# EAGLE design BigTime (EAGLE 6.4)
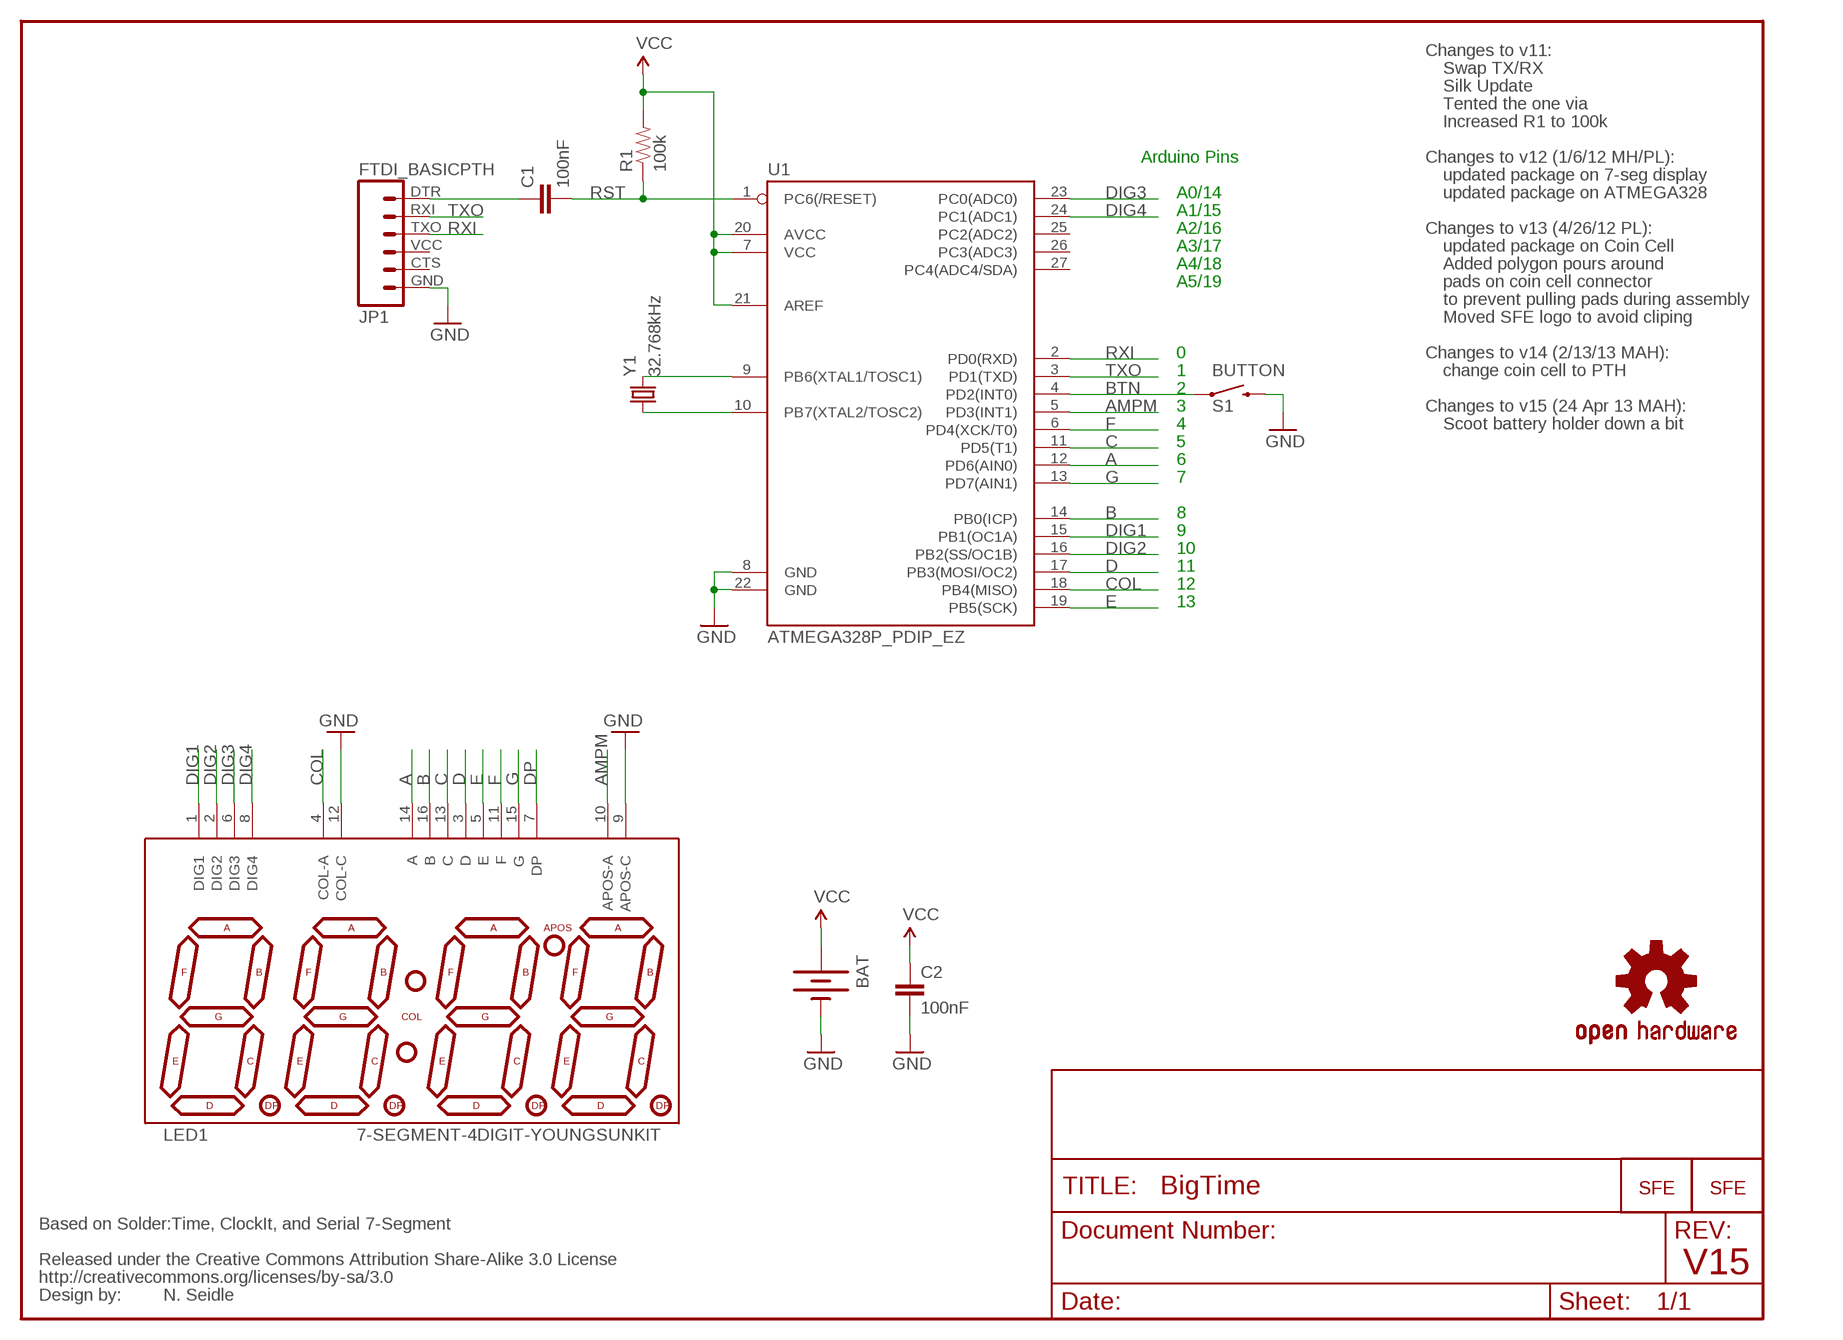
[diagram p0: schematic, sheet 1]

## Parts
BAT  BATTERYFOB  [BATTERY_20MM_PTH_COMPACT]
C1  100nF  CAPEZ  [CAP-PTH-SMALLEZ]
C2  100nF  CAPEZ  [CAP-PTH-SMALLEZ]
JP1  FTDI_BASICPTH  [FTDI_BASIC]
LED1  7-SEGMENT-4DIGIT-YOUNGSUNKIT  [7-SEGMENT-4DIGIT-YOUNGSUN-KIT]
R1  100k  RESISTORKIT  [AXIAL-0.3-KIT]
S1  BUTTON  SWITCH-MOMENTARY-2SIDE_EZ  [TACTILE-PTH-SIDEEZ]
U1  ATMEGA328P_PDIP_EZ  [DIL28-EZ]
U$1  LOGO-SFESK  [SFE-LOGO-FLAME]
U$2  CREATIVE_COMMONS  [CREATIVE_COMMONS]
U$4  OSHW-LOGOS  [OSHW-LOGO-S]
U$5  LOGO-SFENW2  [SFE-NEW-WEB]
Y1  32.768kHz  CRYSTALTC26H_EZ  [TC26HEZ]

## Nets
A: LED1.14(A) U1.12(PD6(AIN0))
AMPM: LED1.10(APOS-A) U1.5(PD3(INT1))
B: LED1.16(B) U1.14(PB0(ICP))
BTN: S1.1 U1.4(PD2(INT0))
C: LED1.13(C) U1.11(PD5(T1))
COL: LED1.4(COL-A) U1.18(PB4(MISO))
D: LED1.3(D) U1.17(PB3(MOSI/OC2))
DIG1: LED1.1(DIG1) U1.15(PB1(OC1A))
DIG2: LED1.2(DIG2) U1.16(PB2(SS/OC1B))
DIG3: LED1.6(DIG3) U1.23(PC0(ADC0))
DIG4: LED1.8(DIG4) U1.24(PC1(ADC1))
DP: LED1.7(DP)
E: LED1.5(E) U1.19(PB5(SCK))
F: LED1.11(F) U1.6(PD4(XCK/T0))
G: LED1.15(G) U1.13(PD7(AIN1))
GND: BAT.2(-) C2.2 JP1.GND LED1.9(APOS-C) LED1.12(COL-C) S1.2 U1.8(GND) U1.22(GND)
N$1: U1.10(PB7(XTAL2/TOSC2)) Y1.1
N$2: U1.9(PB6(XTAL1/TOSC1)) Y1.2
N$3: C1.1 JP1.DTR
RST: C1.2 R1.P$1 U1.1(PC6(/RESET))
RXI: JP1.TXO U1.2(PD0(RXD))
TXO: JP1.RXI U1.3(PD1(TXD))
VCC: BAT.1(+) C2.1 R1.P$2 U1.7(VCC) U1.20(AVCC) U1.21(AREF)
Unconnected: JP1.CTS JP1.VCC U1.25(PC2(ADC2)) U1.26(PC3(ADC3)) U1.27(PC4(ADC4/SDA))

## Notes on the sheet
- Changes to v11:
- Swap TX/RX
- Silk Update
- Tented the one via
- Increased R1 to 100k
- Arduino Pins | Changes to v12 (1/6/12 MH/PL):
- updated package on 7-seg display
- A0/14 | updated package on ATMEGA328
- A1/15
- A2/16 | Changes to v13 (4/26/12 PL):
- A3/17 | updated package on Coin Cell
- A4/18 | Added polygon pours around
- A5/19 | pads on coin cell connector
- to prevent pulling pads during assembly
- Moved SFE logo to avoid cliping
- 0 | Changes to v14 (2/13/13 MAH):
- 1 | change coin cell to PTH
- 2
- 3 | Changes to v15 (24 Apr 13 MAH):
- 4 | Scoot battery holder down a bit
- 5
- 6
- 7
- 8
- 9
- 10
- 11
- 12
- 13
- Based on Solder:Time, ClockIt, and Serial 7-Segment
- V15
- N. Seidle

## Library data of the parts
BAT = SparkFun-Electromechanical:BATTERY: Battery Holders Various common sizes : AA, AAA, 20mm coin cell and 12mm coin cell. 20MM_4LEGS, BATT-10373
C1 C2 = SparkFun-Passives:CAP: Capacitor Standard 0603 ceramic capacitor, and 0.1" leaded capacitor.
JP1 = SparkFun:FTDI_BASIC: FTDI Basic: 3.3V and 5V
LED1 = Testing:7-SEGMENT-4DIGIT-YOUNGSUN: This is a part for the 4-Digit 7-segment LEDs from Young Sun. Different from the Digikey LEDs, all 16 pins are used. The LONGPADS Variant is used for a test jig, but you may like it because there is more pad to solder to. If you are concerned about routing space, the standard works just fine though.
R1 = SparkFun-Passives:RESISTOR: Resistor Basic schematic elements and footprints for 0603, 1206, and PTH resistors.
S1 = SparkFun-Electromechanical:SWITCH-MOMENTARY-2: Various NO switches- pushbuttons, reed, etc
U1 = SparkFun-DigitalIC:ATMEGA328P_PDIP_EZ: uC used in the Arduino 32kb flash, 1k EEPROM, 2k SRAM This is the through-hole version of this chip.
U$1 U$5 = SparkFun:LOGO-SFE: Spark Fun Electronics PCB Logo This is the standard Spark Fun Electronics PCB logo.
U$2 = SparkFun:CREATIVE_COMMONS
U$4 = SparkFun:OSHW-LOGO: Open Source Hardware Logo This logo indicates the piece of hardware it is found on incorporates a OSHW license and/or adheres to the definition of open source hardware found here: http://freedomdefined.org/OSHW
Y1 = SparkFun-FreqCtrl:CRYSTAL: Various standard crystals. Proven footprints. Spark Fun Electronics SKU : COM-00534

## Board
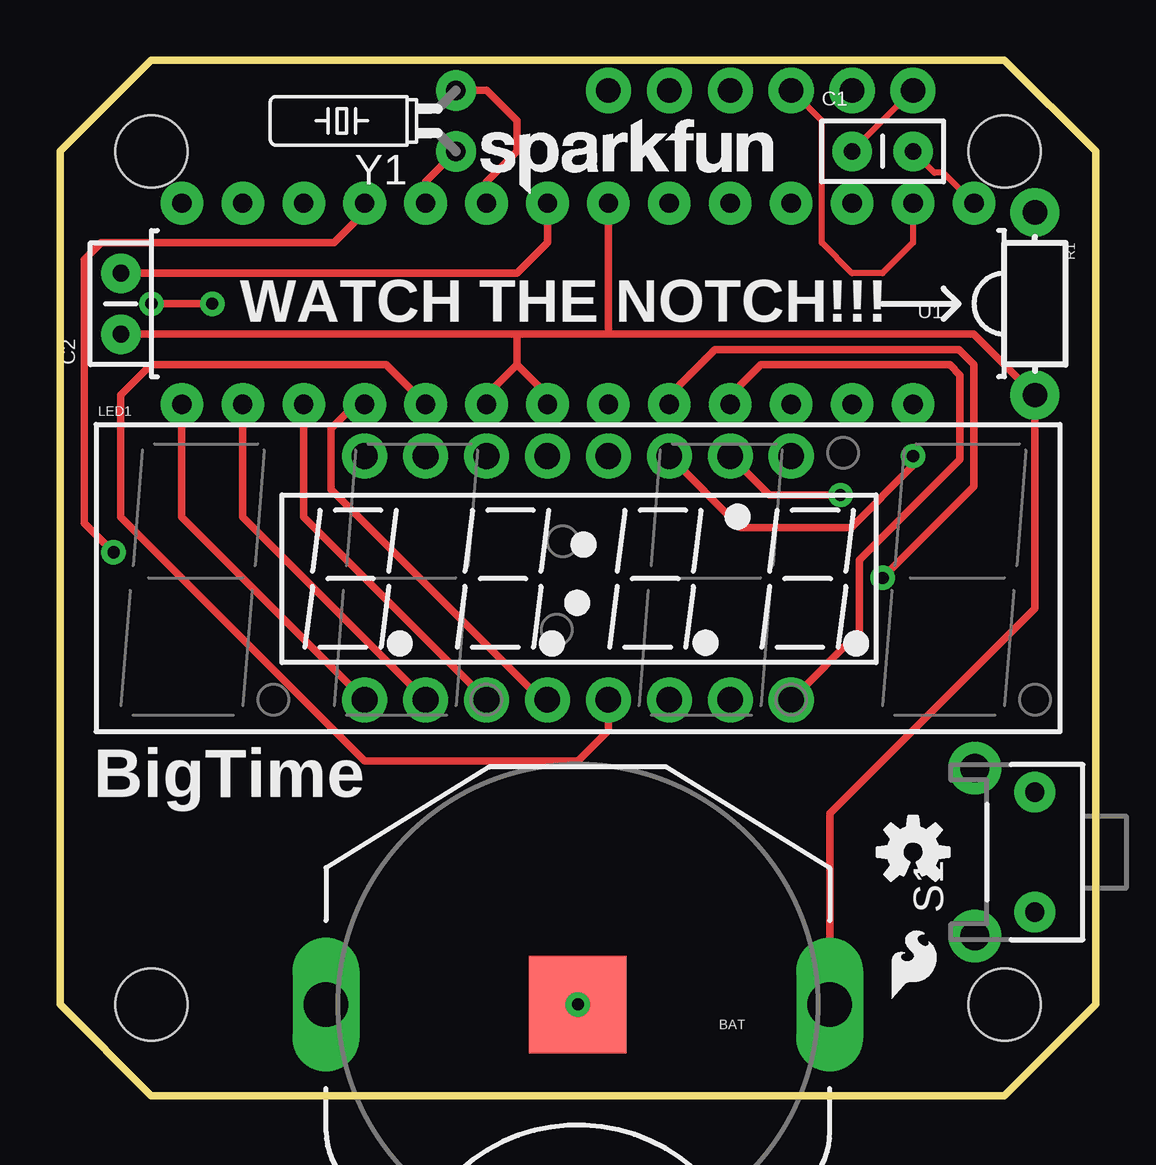
[diagram p1: board, top side]
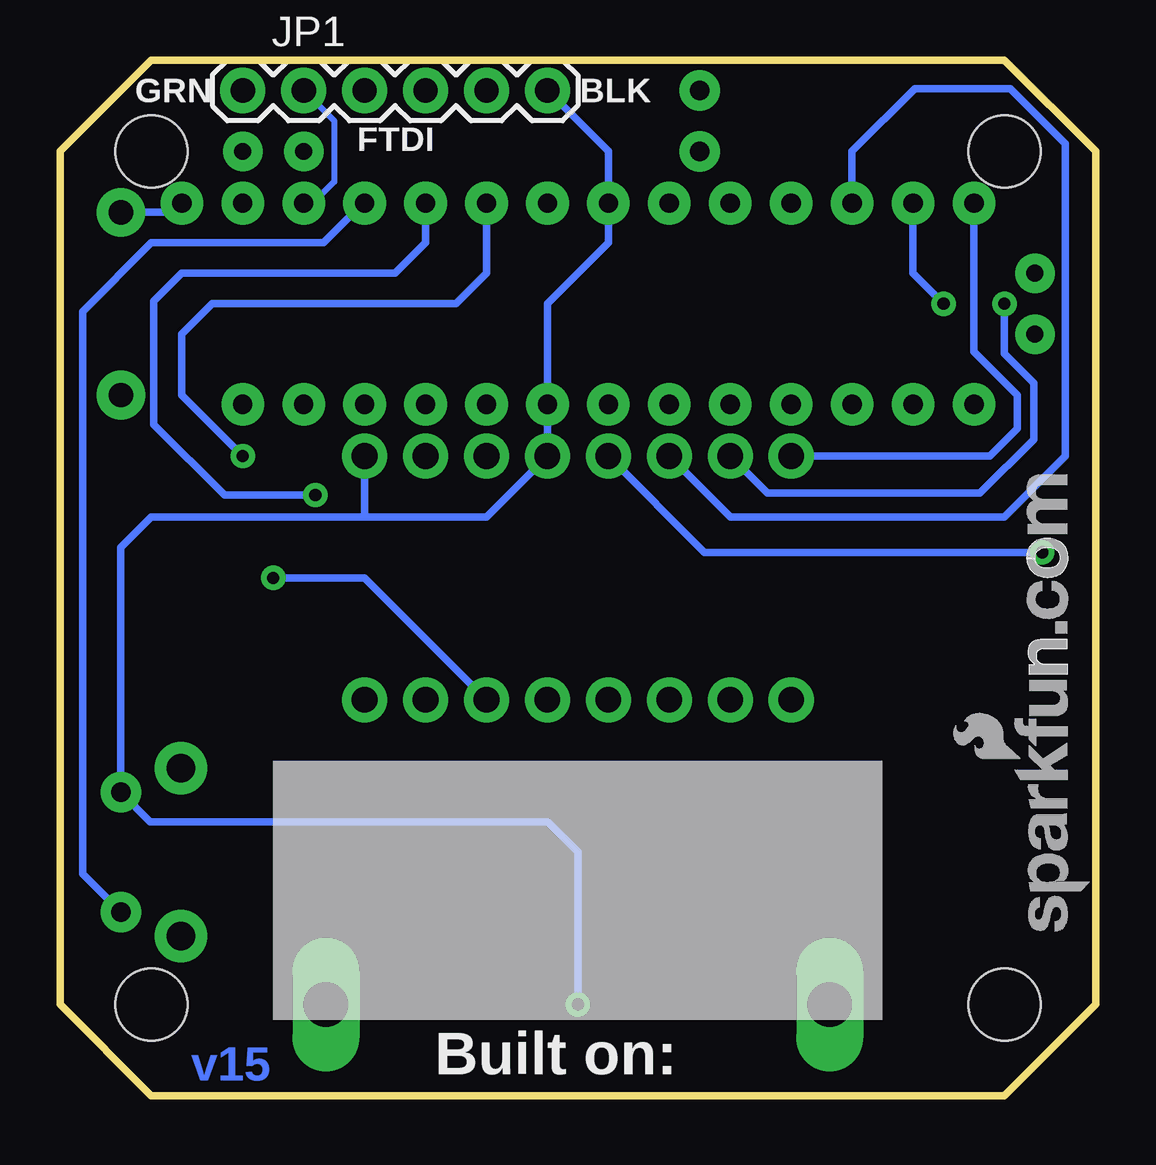
[diagram p2: board, bottom side, seen from below]

Size 43.18 x 43.18 mm. Coordinates in mm from the lower left corner, seen from the top.
Outline: 0,39.37 0,3.81 3.81,0 39.37,0 43.18,3.81 43.18,39.37 39.37,43.18 3.81,43.18 0,39.37
Copper layers (1*16): Top 0.035mm / dielectric 1.5mm / Bottom 0.035mm
Design rules "default": minimum track width 8mil, minimum drill 20mil, track to track 8mil, track to pad 8mil, pad to pad 8mil, via to via 8mil, smd to smd 8mil, copper to edge 8mil, drill to drill 8mil, minimum pad ring 12mil, minimum via ring 10mil, stop-mask expansion 4mil, vias tented up to drill 20mil, thermal gap 10mil
Holes 3 mm at 3.81,39.37 39.37,3.81 39.37,39.37 3.81,3.81

### Footprints (pad centres in the part's own frame; a part is rotated, then mirrored left to right if it is on the bottom)
BATTERY_20MM_PTH_COMPACT = drill 1.854 long: 1 -10.5,0; 3 10.5,0 | smd 4.064 x 4.064: 2 0,0
CAP-PTH-SMALLEZ = drill 0.7 pad 1.651: 1 0,0; 2 2.54,0
FTDI_BASIC = drill 1.016 pad 1.88: CTS 10.16,0; DTR 0,0; GND 12.7,0; RXI 2.54,0; TXO 5.08,0; VCC 7.62,0
7-SEGMENT-4DIGIT-YOUNGSUN-KIT = drill 1.067 pad 1.88: 1 -8.89,-5.08; 2 -6.35,-5.08; 3 -3.81,-5.08; 4 -1.27,-5.08; 5 1.27,-5.08; 6 3.81,-5.08; 7 6.35,-5.08; 8 8.89,-5.08; 9 8.89,5.08; 10 6.35,5.08; 11 3.81,5.08; 12 1.27,5.08; 13 -1.27,5.08; 14 -3.81,5.08; 15 -6.35,5.08; 16 -8.89,5.08
AXIAL-0.3-KIT = drill 1.016 pad 2.032: P$1 -3.81,0; P$2 3.81,0
TACTILE-PTH-SIDEEZ = drill 0.8 pad 1.7: 1 -2.5,0; 2 2.5,0 | drill 1.2 pad 2.2: ANCHOR1 -3.5,2.5; ANCHOR2 3.5,2.5
DIL28-EZ = drill 0.8 pad 1.778: 1 -16.51,-4.191; 2 -13.97,-4.191; 3 -11.43,-4.191; 4 -8.89,-4.191; 5 -6.35,-4.191; 6 -3.81,-4.191; 7 -1.27,-4.191; 8 1.27,-4.191; 9 3.81,-4.191; 10 6.35,-4.191; 11 8.89,-4.191; 12 11.43,-4.191; 13 13.97,-4.191; 14 16.51,-4.191; 15 16.51,4.191; 16 13.97,4.191; 17 11.43,4.191; 18 8.89,4.191; 19 6.35,4.191; 20 3.81,4.191; 21 1.27,4.191; 22 -1.27,4.191; 23 -3.81,4.191; 24 -6.35,4.191; 25 -8.89,4.191; 26 -11.43,4.191; 27 -13.97,4.191
TC26HEZ = drill 0.813 pad 1.676: 1 -1.27,0; 2 1.27,0

### Placement (x,y rotation side)
BAT  21.59,3.81 180 top
C1  33.02,39.37 0 top
C2  2.54,31.75 90 top
JP1  35.56,41.91 0 bottom
LED1  21.59,21.59 0 top
R1  40.64,33.02 270 top
S1  40.64,10.16 90 top
U1  21.59,33.02 180 top
U$1  34.67,4.06 0 top
U$2  -6.35,-10.16 0 top  (outside the outline)
U$3  LOGO-SFENEW  [SFE-NEW-WEBLOGO]  0.25,6.86 90 bottom
U$4  35.56,10.16 0 top
U$5  17.53,37.59 0 top
Y1  16.51,40.64 90 top

### Tracks (layer width: path | path; a pad name or v marks a point on that pad's centre or on a via)
A
  Bottom 0.305: LED1.14 15.24,24.13 3.81,24.13 1.27,26.67 1.27,39.7 3.56,41.99 7.54,41.99 10.16,39.37 U1.12
AMPM  (via drill 0.51)
  Top 0.305: LED1.10 29.57,25.04 v32.54,25.04
  Bottom 0.305: v32.54,25.04 36.32,25.04 39.27,27.99 39.27,33.12 38.1,34.29 29.21,34.29 27.94,35.56 U1.5
B
  Bottom 0.305: LED1.16 4.42,26.67 3.28,27.81 3.28,29.21 5.08,31.01 U1.14
BTN
  Bottom 0.305: U1.4 30.54,37.21 32.19,35.56 39.37,35.56 42.24,32.69 42.24,9.26 S1.1
C  (via drill 0.51)
  Top 0.305: v2.23,22.66 1.02,23.88 1.02,34.85 1.73,35.56 11.43,35.56 12.7,36.83 U1.11
  Bottom 0.305: v2.23,22.66 16.31,22.66 LED1.13
COL
  Top 0.305: LED1.4 20.07,16.51 11.3,25.27 11.3,27.81 12.32,28.83 U1.18
D
  Top 0.305: LED1.3 10.16,24.13 U1.17
DIG1
  Top 0.305: LED1.1 5.08,24.13 U1.15
DIG2
  Top 0.305: LED1.2 7.62,24.13 U1.16
DIG3  (via drill 0.51)
  Top 0.254: U1.23 25.4,29.21
  Top 0.305: v34.29,21.59 38.1,25.4 38.1,30.48 37.47,31.11 27.3,31.11 25.4,29.21
  Bottom 0.305: v34.29,21.59 30.48,21.59 LED1.6
DIG4
  Top 0.254: U1.24 27.94,29.21
  Top 0.305: LED1.8 33.33,19.36 33.33,22.33 37.52,26.52 37.52,30.05 37.08,30.48 29.21,30.48 27.94,29.21
E
  Top 0.305: LED1.5 22.86,15.24 21.59,13.97 12.7,13.97 2.54,24.13 2.54,29.21 3.81,30.48 13.59,30.48 U1.19
F  (via drill 0.51)
  Top 0.305: v35.56,26.67 35.56,26.26 32.99,23.7 28.37,23.7 LED1.11
  Bottom 0.305: v35.56,26.67 38.1,29.21 38.1,31.75 36.83,33.02 26.67,33.02 25.4,34.29 U1.6
G  (via drill 0.51)
  Top 0.305: v3.81,33.02 v6.35,33.02
  Bottom 0.305: LED1.15 13.69,25.12 4.83,25.12 2.59,27.36 2.59,29.72 3.81,30.94 v3.81,33.02 | v6.35,33.02 7.62,34.29 U1.13
GND  (via drill 0.51)
  Top 0.305: U1.8 20.32,35.56 19.05,34.29 C2.2
  Bottom 0.305: 30.48,24.13 25.4,24.13 LED1.12 U1.22 22.86,33.02 20.32,35.56 U1.8 20.32,39.37 JP1.GND | 30.48,24.13 LED1.9 | 30.48,24.13 39.37,24.13 40.64,22.86 S1.2 39.41,11.43 22.86,11.43 21.59,10.16 BAT.2
  other vias: 21.59,3.81
N$1
  Top 0.305: U1.10 15.24,38.1 Y1.1
N$2
  Top 0.305: U1.9 17.78,38.1 19.05,39.37 19.05,40.64 17.78,41.91 Y1.2
N$3
  Top 0.254: JP1.DTR C1.1
RST
  Top 0.254: U1.1 36.83,38.48 36.45,38.48 C1.2
  Bottom 0.305: R1.P$1 38.48,36.83 U1.1
RXI
  Top 0.254: U1.2 35.56,35.56 34.29,34.29 33.02,34.29 31.75,35.56 31.75,40.64 JP1.TXO
TXO
  Bottom 0.254: JP1.RXI 31.75,40.64 31.75,38.1 32.64,37.21 U1.3
VCC
  Top 0.305: 19.05,31.75 22.86,31.75 | 22.86,31.75 38.1,31.75 R1.P$2 40.64,20.32 32.09,11.77 BAT.1 | U1.20 17.78,29.21 19.05,30.48 | 19.05,31.75 19.05,30.48 | U1.21 20.32,29.21 19.05,30.48 | U1.7 22.86,31.75 | C2.1 19.05,31.75

### Text on the board
Bottom: v15
tPlace: WATCH THE NOTCH!!! | BigTime
bPlace: BLK | GRN | FTDI | Built on:
Document: N. Seidle